# EAGLE design I2C-Buffer_Adapter (EAGLE 6.5.0)
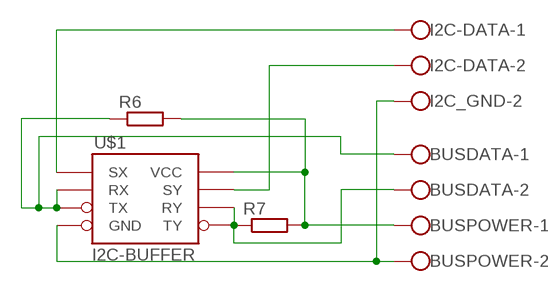
[diagram p0: schematic, sheet 1]

## Parts
BUSDATA  W237-102  [W237-102]
BUSPOWER  W237-102  [W237-102]
I2C-DATA  W237-102  [W237-102]
I2C_GND  W237-102  [W237-102]
R6  R-EU_0207/12  [0207/12]
R7  R-EU_0207/12  [0207/12]
U$1  I2C-BUFFER  [I2C-BUFFER]

## Nets
N$1: I2C-DATA.1 U$1.1(SX)
N$2: BUSPOWER.2 I2C_GND.2 U$1.4(GND)
N$3: I2C-DATA.2 U$1.7(SY)
N$7: BUSPOWER.1 R6.2 R7.2 U$1.8(VCC)
N$8: BUSDATA.2 R7.1 U$1.5(TY) U$1.6(RY)
N$9: BUSDATA.1 R6.1 U$1.2(RX) U$1.3(TX)
Unconnected: I2C_GND.1

## Library data of the parts
BUSDATA BUSPOWER I2C-DATA I2C_GND = con-wago-500:W237-102: WAGO SCREW CLAMP; MPN: 237-102; OC_FARNELL: unknown; OC_NEWARK: 70K9898
R6 R7 = resistor:R-EU_: RESISTOR, European symbol
U$1 = Custom:I2C-BUFFER

## Net classes
0 Power: width 1.5 mm, drill 0.5 mm, clearance 1 mm
1 Signal: width 0.75 mm, drill 0.5 mm, clearance 0.5 mm
2 Tiny signal: width 0.406 mm

## Board
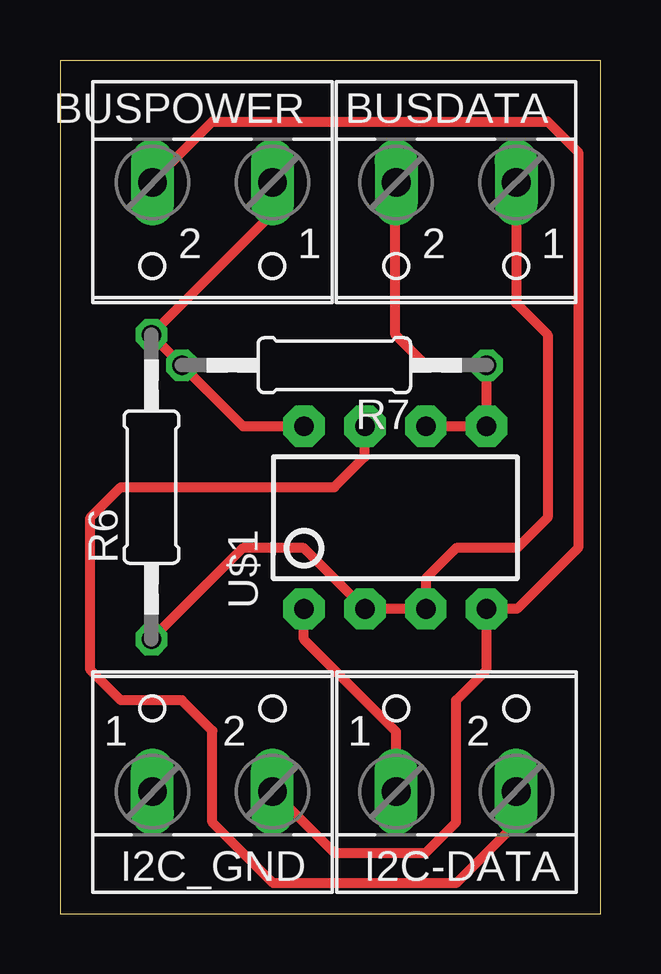
[diagram p1: board, top side]
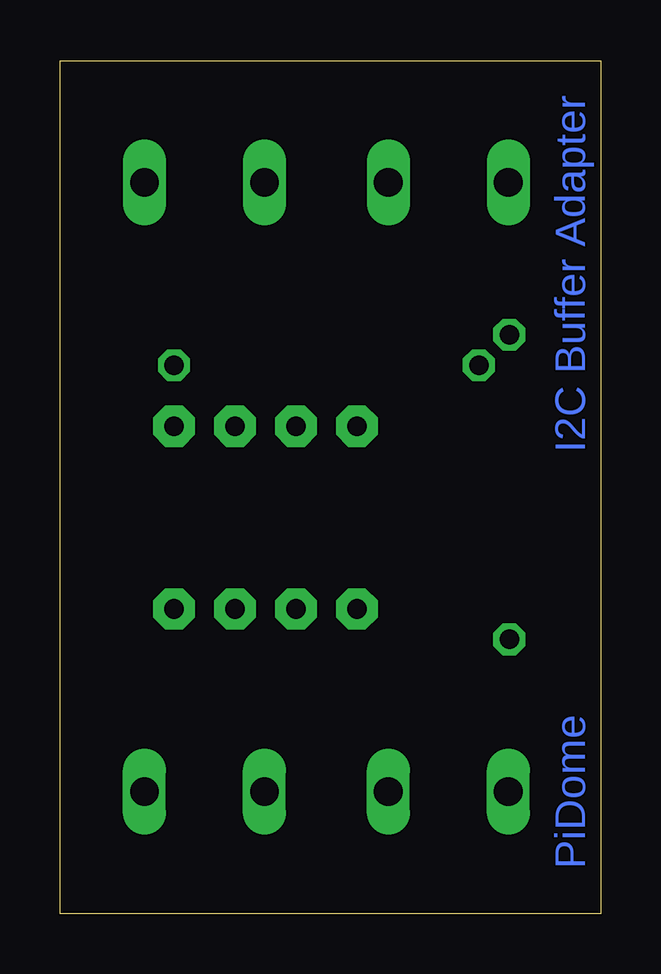
[diagram p2: board, bottom side, seen from below]

Size 22.53 x 35.55 mm. Coordinates in mm from the lower left corner, seen from the top.
Outline: 0,0 22.53,0 22.53,35.55 0,35.55 0,0
Copper layers (1*16): Top 0.035mm / dielectric 1.5mm / Bottom 0.035mm
Design rules "default": minimum track width 10mil, minimum drill 24mil, track to track 8mil, track to pad 8mil, pad to pad 8mil, via to via 8mil, smd to smd 8mil, copper to edge 40mil, drill to drill 8mil, minimum pad ring 10mil, minimum via ring 8mil, stop-mask expansion 4mil, vias tented up to drill 0mil, thermal gap 10mil

### Footprints (pad centres in the part's own frame; a part is rotated, then mirrored left to right if it is on the bottom)
W237-102 = drill 1.194 long: 1 -2.5,-1.27; 2 2.5,-1.27
0207/12 = drill 0.813 octagon: 1 -6.35,0; 2 6.35,0
I2C-BUFFER = drill 0.813 pad 1.727 octagon: 1 -2.54,-3.81; 2 0,-3.81; 3 2.54,-3.81; 4 5.08,-3.81; 5 5.08,3.81; 6 2.54,3.81; 7 0,3.81; 8 -2.54,3.81

### Placement (x,y rotation side)
BUSDATA  16.51,29.21 180 top
BUSPOWER  6.35,29.21 180 top
I2C-DATA  16.51,6.35 0 top
I2C_GND  6.35,6.35 0 top
R6  3.81,17.78 90 top
R7  11.43,22.86 180 top
U$1  12.7,16.51 0 top

### Tracks (layer width: path | path; a pad name or v marks a point on that pad's centre or on a via)
N$1
  Top 0.406: I2C-DATA.1 14.01,7.58 10.16,11.43 U$1.1
N$2
  Top 0.406: BUSPOWER.2 3.85,30.52 6.35,33.02 20.32,33.02 21.59,31.75 21.59,15.24 19.05,12.7 U$1.4 17.78,10.16 16.51,8.89 16.51,3.81 15.24,2.54 11.43,2.54 8.89,5.08 I2C_GND.2
N$3
  Top 0.406: I2C-DATA.2 19.01,3.77 16.51,1.27 8.89,1.27 6.35,3.81 6.35,7.62 5.08,8.89 2.54,8.89 1.27,10.16 1.27,16.51 2.54,17.78 11.43,17.78 12.7,19.05 U$1.7
N$7
  Top 0.406: BUSPOWER.1 8.85,29.17 R6.2 R7.2 7.62,20.32 U$1.8
N$8
  Top 0.406: U$1.6 U$1.5 R7.1 15.24,22.86 13.97,24.13 13.97,30.44 BUSDATA.2
N$9
  Top 0.406: R6.1 7.62,15.24 10.16,15.24 U$1.2 U$1.3 15.24,13.97 16.51,15.24 19.05,15.24 20.32,16.51 20.32,24.13 19.01,25.44 BUSDATA.1

### Text on the board
Bottom: I2C Buffer Adapter | PiDome